# Altium schematic sheet adc_dac_txquad6.SchDoc: mcHF QRP Transceiver RF board
size A4; Author: K Atanassov; CompanyName: M0NKA; Revision: 0.6.3; SheetTotal: 12
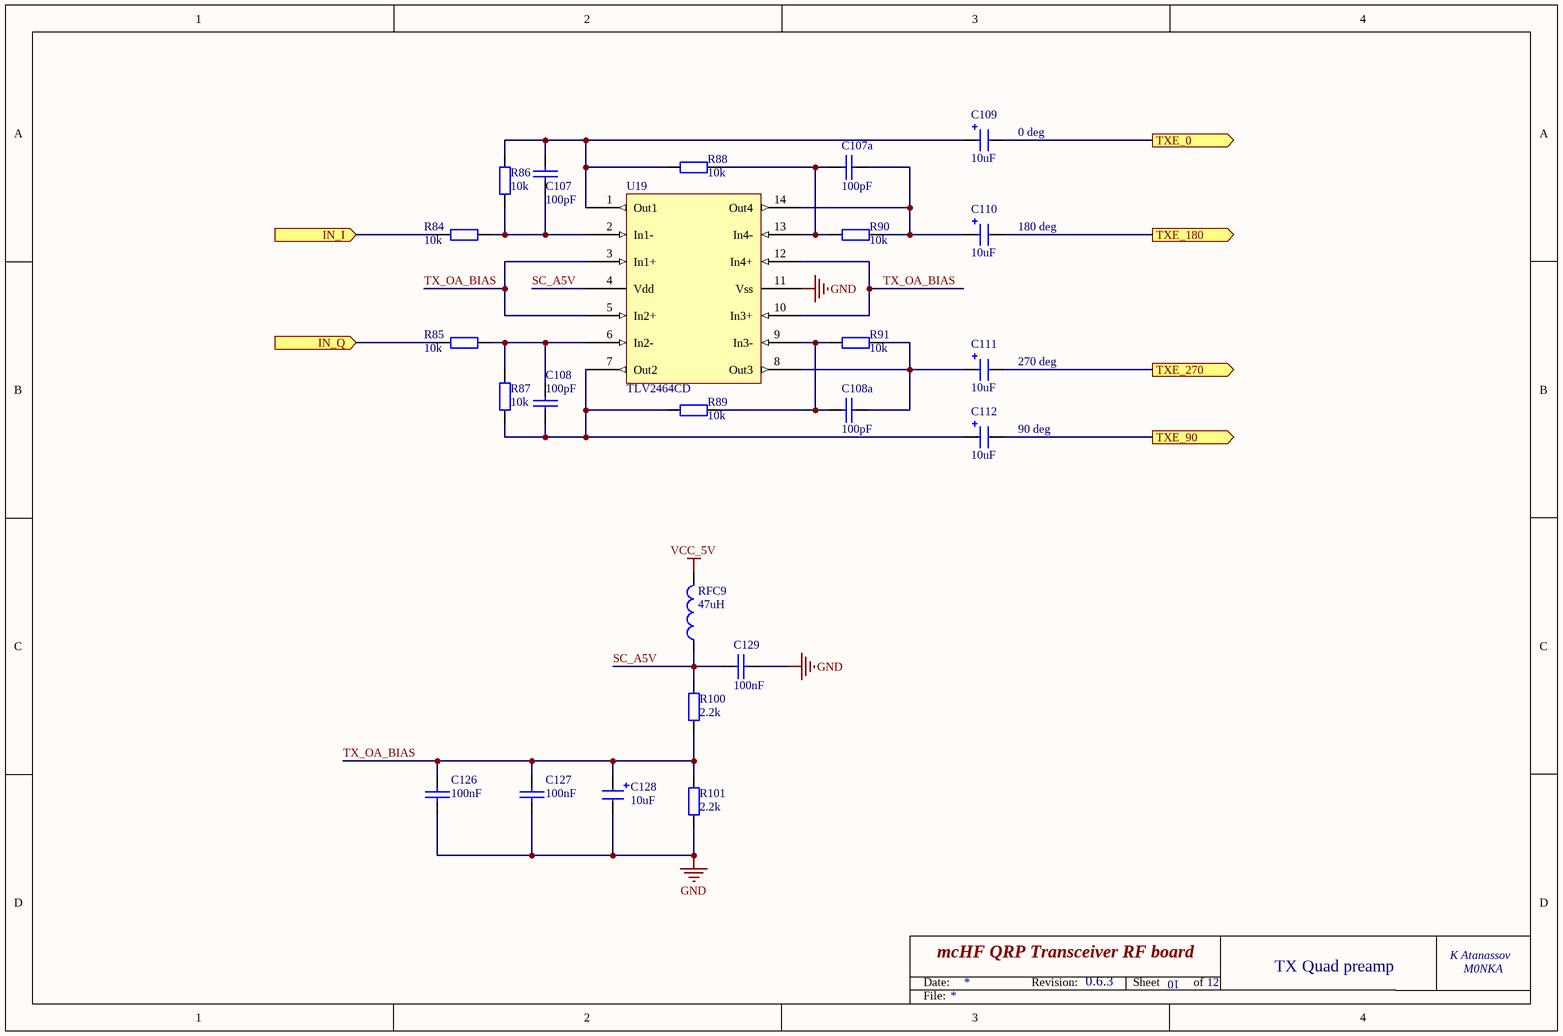
[diagram p0: adc_dac_txquad6.SchDoc]

## Parts
C107  100pF  [0805-Pro]
C107a  100pF  [0805-Pro]
C108  100pF  [0805-Pro]
C108a  100pF  [0805-Pro]
C109  10uF  [1206_Elec_Cap_N]
C110  10uF  [1206_Elec_Cap_N]
C111  10uF  [1206_Elec_Cap_N]
C112  10uF  [1206_Elec_Cap_N]
C126  100nF  [0805-Pro]
C127  100nF  [0805-Pro]
C128  10uF  [1206_Elec_Cap_N]
C129  100nF  [0805-Pro]
R84  10k  [0805-Pro]
R85  10k  [0805-Pro]
R86  10k  [0805-Pro]
R87  10k  [0805-Pro]
R88  10k  [0805-Pro]
R89  10k  [0805-Pro]
R90  10k  [0805-Pro]
R91  10k  [0805-Pro]
R100  2.2k  [0805-Pro]
R101  2.2k  [0805-Pro]
RFC9  47uH  [0805-Pro]
U19  TLV2464CD  [SO-14-Pro]

## Ports
IN_I (in), IN_Q (in), TXE_0 (out), TXE_90 (out), TXE_180 (out), TXE_270 (out)

## Nets
GND: C126.1 C127.1 C128.2 C129.1 R101.1 U19.11(Vss)
VCC_5V: RFC9.2
IN_I: R84.1 ; port IN_I
IN_Q: R85.1 ; port IN_Q
SC_A5V: C129.2 R100.2 RFC9.1 U19.4(Vdd)
TX_OA_BIAS: C126.2 C127.2 C128.1 R100.1 R101.2 U19.3(In1+) U19.5(In2+) U19.10(In3+) U19.12(In4+)
TXE_0: C109.2 ; port TXE_0
TXE_90: C112.2 ; port TXE_90
TXE_180: C110.2 ; port TXE_180
TXE_270: C111.2 ; port TXE_270
NetC107_1: C107.1 R84.2 R86.1 U19.2(In1-)
NetC107_2: C107.2 C109.1 R86.2 R88.1 U19.1(Out1)
NetC107a_1: C107a.1 C110.1 R90.2 U19.14(Out4)
NetC107a_2: C107a.2 R88.2 R90.1 U19.13(In4-)
NetC108_1: C108.1 C112.1 R87.1 R89.1 U19.7(Out2)
NetC108_2: C108.2 R85.2 R87.2 U19.6(In2-)
NetC108a_1: C108a.1 C111.1 R91.2 U19.8(Out3)
NetC108a_2: C108a.2 R89.2 R91.1 U19.9(In3-)

## Notes on the sheet
- (near C109) 0 deg
- (near C110) 180 deg
- (near C111) 270 deg
- (near C112) 90 deg
- 10
- TX Quad preamp
- Date:
- Revision:
- Sheet
- of
- File:

## Library data of the parts
C107 C107a C108 C108a = CAP: Capacitor; Order: FN 233-2692; Price: 0.056
C109-C112 C128 = CAP-POL: Electrolitic capacitor; Order: FN 233-3009; QT Order: QCC-00166; Price: 0.204
C126 C127 C129 = CAP: Capacitor; Order: FN 252-2090; QT Order: QCC-00154; Price: 0.068
R84-R91 = RES: Resistor; Order: FN 146-9856; QT Order: QCR-00349; Price: 0.021
R100 R101 = RES: Resistor; Order: FN 188-7289; QT Order: QCR-00333; Price: 0.046
RFC9 = TDK-NLV25T: INDUCTOR, SIGNAL LINE, 4.7UH, 1005; Order: FN 166-9895; Price: 0.166
U19 = TLV2464CD: Low Power, Rail-To-Rail OpAmp; Order: FN 845-5171; Price: 1.47